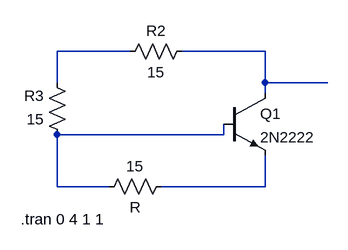
[diagram p0: schematic Draft1.asc]
Draft1.asc, the LTspice schematic file:
Version 4
SHEET 1 880 680
WIRE 80 16 -32 16
WIRE 288 16 160 16
WIRE -32 64 -32 16
WIRE 288 64 288 16
WIRE 384 64 288 64
WIRE 288 80 288 64
WIRE 224 144 224 128
WIRE 224 144 -32 144
WIRE -32 224 -32 144
WIRE 48 224 -32 224
WIRE 288 224 288 176
WIRE 288 224 128 224
SYMBOL res 144 208 R90
WINDOW 0 0 56 VBottom 2
WINDOW 3 32 56 VTop 2
SYMATTR InstName 15
SYMBOL res 176 0 R90
WINDOW 0 0 56 VBottom 2
WINDOW 3 32 56 VTop 2
SYMATTR InstName R2
SYMATTR Value 15
SYMBOL res -16 160 R180
WINDOW 0 36 76 Left 2
WINDOW 3 36 40 Left 2
SYMATTR InstName R3
SYMATTR Value 15
SYMBOL npn 224 80 R0
SYMATTR InstName Q1
SYMATTR Value 2N2222
TEXT -88 274 Left 2 !.tran 0 4 1 1

The netlist it stands for:
* Draft1.asc
R§15 N004 N003 R
R2 N002 N001 15
R3 N003 N001 15
Q1 N002 N003 N004 0 2N2222
.model NPN NPN
.model PNP PNP
.lib standard.bjt
.tran 0 4 1 1
.backanno
.end